# EAGLE design sensor (EAGLE 6.6.0)
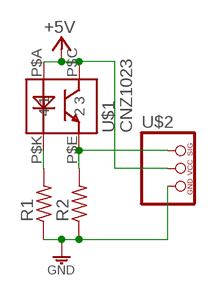
[diagram p0: schematic, sheet 1]

## Parts
R1  RESISTORS  [R_3216]
R2  RESISTORS  [R_3216]
U$1  CNZ1023  [CNZ1023]
U$2  PINHD-SENSOR  [1*03(KIKAKU)]

## Nets
+5V: U$1.P$A U$1.P$C U$2.VCC
GND: R1.1 R2.1 U$2.GND
N$1: R1.2 U$1.P$K
N$2: R2.2 U$1.P$E U$2.SIG

## Library data of the parts
R1 R2 = rcl__s:RESISTORS
U$1 = Photointerrupter:CNZ1023
U$2 = pinhead_s:PINHD-SENSOR

## Board
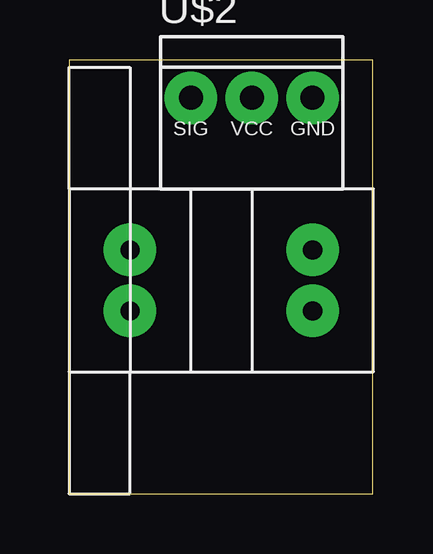
[diagram p1: board, top side]
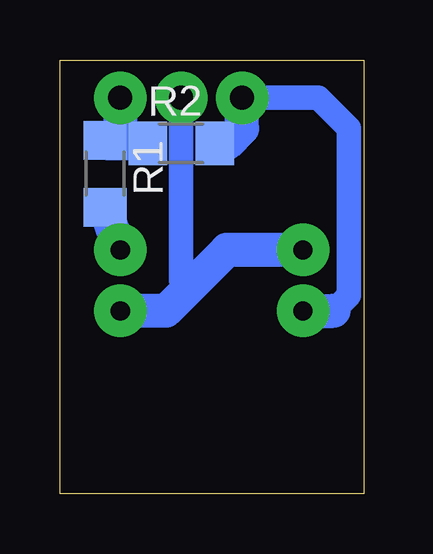
[diagram p2: board, bottom side, seen from below]

Size 12.68 x 18.09 mm. Coordinates in mm from the lower left corner, seen from the top.
Outline: 0,0 12.68,0 12.68,18.09 0,18.09 0,0
Copper layers (1*16): Top 0.035mm / dielectric 1.5mm / Bottom 0.035mm
Design rules "default": minimum track width 10mil, minimum drill 24mil, track to track 8mil, track to pad 8mil, pad to pad 8mil, via to via 8mil, smd to smd 8mil, copper to edge 40mil, drill to drill 8mil, minimum pad ring 10mil, minimum via ring 8mil, stop-mask expansion 4mil, vias tented up to drill 0mil, thermal gap 10mil

### Footprints (pad centres in the part's own frame; a part is rotated, then mirrored left to right if it is on the bottom)
R_3216 = smd 1.6 x 1.8: 1 -1.4,0; 2 1.4,0
CNZ1023 = drill 0.8 pad 2.184: P$A -7.62,2.54; P$C 0,0; P$E 0,2.54; P$K -7.62,0
1*03(KIKAKU) = drill 1 pad 2.184: GND 2.54,1.27; SIG -2.54,1.27; VCC 0,1.27

### Placement (x,y rotation side)
R1  10.79,13.34 270 bottom
R2  7.62,14.61 0 bottom
U$1  2.54,10.16 180 top
U$2  7.62,15.24 0 top

### Tracks (layer width: path | path; a pad name or v marks a point on that pad's centre or on a via)
+5V
  Bottom 1.016: U$2.VCC 7.62,8.89 7.3,8.57
  Bottom 1.422: U$1.P$C 5.71,10.16 7.3,8.57 8.26,7.62 U$1.P$A
GND
  Bottom 1.422: R2.1 10.16,14.61 | 10.16,14.61 10.66,14.61 R1.1 | U$2.GND 10.16,14.61
N$1
  Bottom 1.422: U$1.P$K R1.2
N$2
  Bottom 1.016: 1.27,7.62 0.64,8.25 0.64,15.24 1.91,16.51 U$2.SIG
  Bottom 1.422: U$1.P$E 1.27,7.62 | R2.2 5.71,14.61 5.08,15.24 U$2.SIG